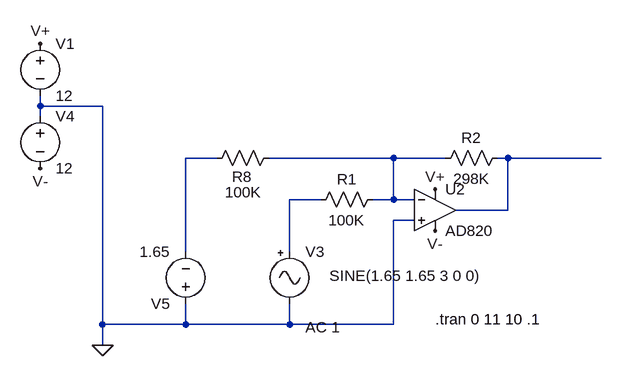
[diagram p0: schematic spank_output_analog2.asc]
spank_output_analog2.asc, the LTspice schematic file:
Version 4
SHEET 1 880 792
WIRE -400 288 -400 272
WIRE -304 288 -400 288
WIRE -400 304 -400 288
WIRE -128 368 -176 368
WIRE 144 368 -48 368
WIRE 224 368 144 368
WIRE 320 368 304 368
WIRE 464 368 320 368
WIRE 32 432 -16 432
WIRE 144 432 144 368
WIRE 144 432 112 432
WIRE 176 432 144 432
WIRE 320 448 320 368
WIRE 320 448 240 448
WIRE 176 464 144 464
WIRE -176 512 -176 368
WIRE -16 512 -16 432
WIRE -304 624 -304 288
WIRE -176 624 -176 592
WIRE -176 624 -304 624
WIRE -16 624 -16 592
WIRE -16 624 -176 624
WIRE 144 624 144 464
WIRE 144 624 -16 624
WIRE -304 656 -304 624
FLAG -400 192 V+
FLAG 208 416 V+
FLAG -400 384 V-
FLAG 208 480 V-
FLAG -304 656 0
SYMBOL res 320 352 R90
WINDOW 0 0 56 VBottom 2
WINDOW 3 32 56 VTop 2
SYMATTR InstName R2
SYMATTR Value 298K
SYMBOL Misc\\signal -16 496 R0
WINDOW 123 24 132 Left 2
WINDOW 39 0 0 Left 0
WINDOW 3 61 53 Left 2
SYMATTR Value2 AC 1
SYMATTR Value SINE(1.65 1.65 3 0 0)
SYMATTR InstName V3
SYMBOL Opamps\\AD820 208 384 R0
SYMATTR InstName U2
SYMBOL voltage -400 176 R0
WINDOW 123 0 0 Left 0
WINDOW 39 0 0 Left 0
SYMATTR InstName V1
SYMATTR Value 12
SYMBOL voltage -400 288 R0
WINDOW 123 0 0 Left 0
WINDOW 39 0 0 Left 0
SYMATTR InstName V4
SYMATTR Value 12
SYMBOL res 128 416 R90
WINDOW 0 0 56 VBottom 2
WINDOW 3 32 56 VTop 2
SYMATTR InstName R1
SYMATTR Value 100K
SYMBOL voltage -176 608 R180
WINDOW 123 0 0 Left 0
WINDOW 39 0 0 Left 0
SYMATTR InstName V5
SYMATTR Value 1.65
SYMBOL res -32 352 R90
WINDOW 0 60 57 VBottom 2
WINDOW 3 53 55 VTop 2
SYMATTR InstName R8
SYMATTR Value 100K
TEXT 208 616 Left 2 !.tran 0 11 10 .1

The netlist it stands for:
* spank_output_analog2.asc
R2 N003 N002 298K
V3 N004 0 SINE(1.65 1.65 3 0 0) AC 1
XU2 0 N002 V+ V- N003 AD820  ; pins In+ In- V+ V- OUT
V1 V+ 0 12
V4 0 V- 12
R1 N002 N004 100K
V5 0 N001 1.65
R8 N002 N001 100K
.tran 0 11 10 .1
.backanno
.end